# Altium schematic sheet NiosII_VGA.SchDoc: FPGA NiosII VGA Example
size C; Organization: Altium Limited; Address1: L3, 12a Rodborough Rd; Address2: Frenchs Forest; Address3: NSW; Address4: Australia 2086; DocumentNumber: 1; SheetNumber: 1; SheetTotal: 1
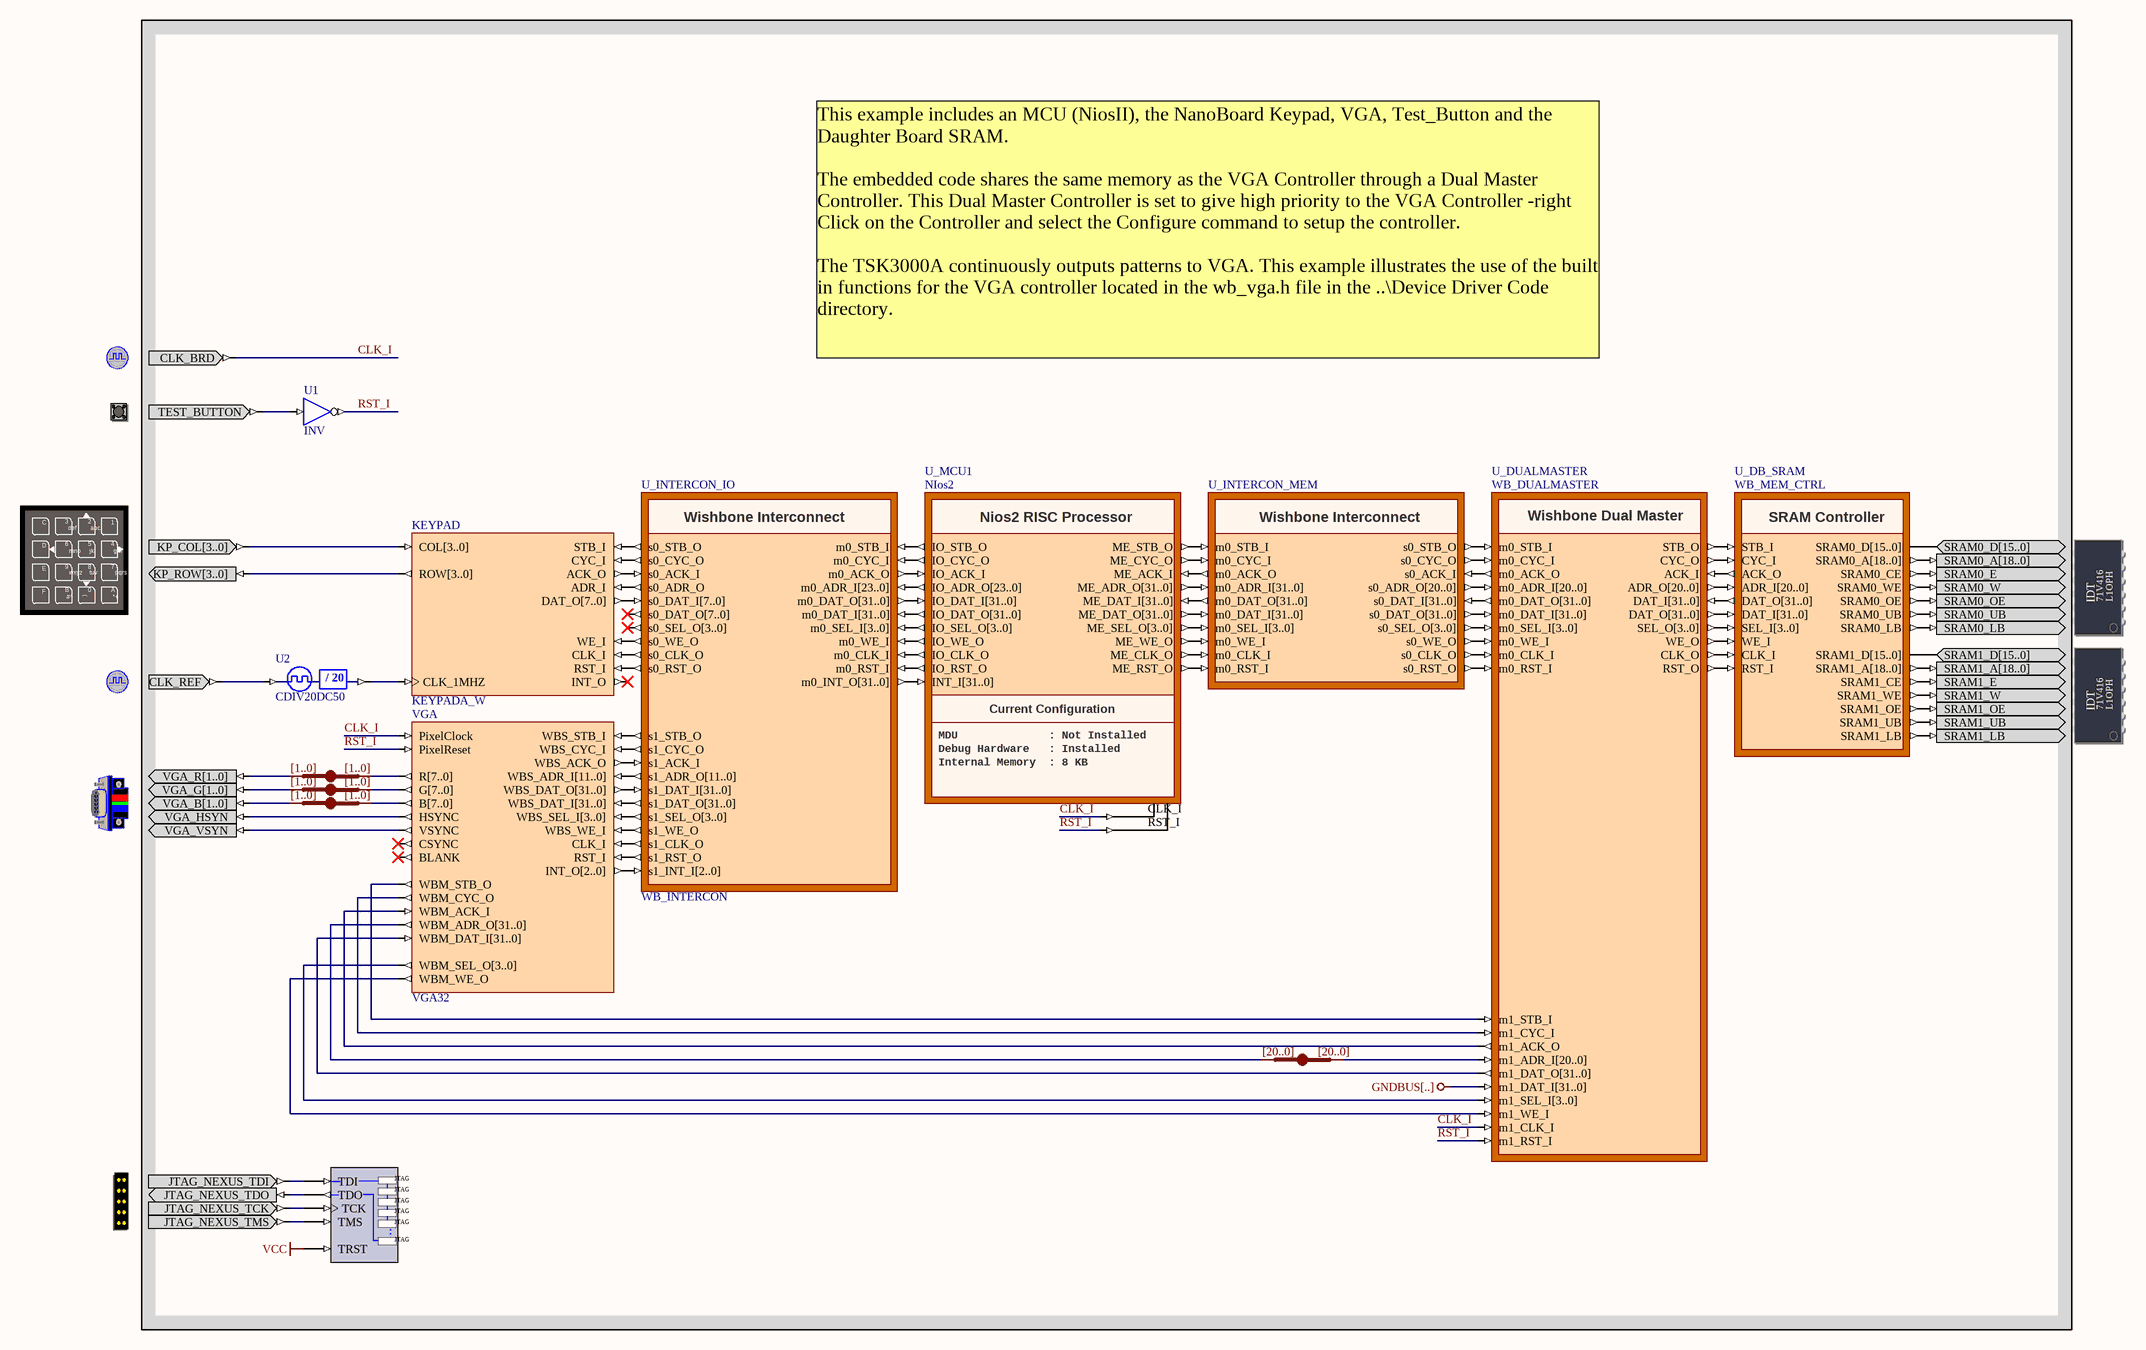
[diagram p0: NiosII_VGA.SchDoc]

## Parts
(Parts that share a designator on the sheet are numbered #1, #2 ... from top to bottom, then left to right.)
?#1  CLOCK_BOARD  (value not drawn)
?#2  TEST_BUTTON  (value not drawn)
?#3  KEYPAD  (value not drawn)
?#4  SRAM_DAUGHTER0  (value not drawn)
?#5  SRAM_DAUGHTER1  (value not drawn)
?#6  CLOCK_REFERENCE  (value not drawn)
?#7  VGACNTR  (value not drawn)
?#8  NEXUS_JTAG_CONNECTOR  (value not drawn)
JB_AUTO?#1  IndexA: [1..0]  (hidden comment: JB)
JB_AUTO?#2  IndexA: [1..0]  (hidden comment: JB)
JB_AUTO?#3  IndexA: [1..0]  (hidden comment: JB)
JB_AUTO?#4  IndexA: [20..0]  (hidden comment: JB)
KEYPAD  KEYPADA_W
NEXUS_JTAG_PORT  NEXUS_JTAG_PORT  (value not drawn)
U1  INV
U2  CDIV20DC50
U_DB_SRAM  WB_MEM_CTRL
U_DUALMASTER  WB_DUALMASTER
U_INTERCON_IO  WB_INTERCON
U_INTERCON_MEM  (no value)
U_MCU1  NIos2
VGA  VGA32

## Nets
GNDBUS[..]: U_DUALMASTER.m1_DAT_I[31..0]
VCC: NEXUS_JTAG_PORT.TRST
CLK_I: ?#1.CLK_BRD U_DUALMASTER.m1_CLK_I U_MCU1.CLK_I VGA.PixelClock
RST_I: U1.O U_DUALMASTER.m1_RST_I U_MCU1.RST_I VGA.PixelReset
Net?#2_TEST_BUTTON: ?#2.TEST_BUTTON U1.I
Net?#3_KP_COL[3..0]: ?#3.KP_COL[3..0] KEYPAD.COL[3..0]
Net?#3_KP_ROW[3..0]: ?#3.KP_ROW[3..0] KEYPAD.ROW[3..0]
Net?#4_SRAM0_A[18..0]: ?#4.SRAM0_A[18..0] U_DB_SRAM.SRAM0_A[18..0]
Net?#4_SRAM0_D[15..0]: ?#4.SRAM0_D[15..0] U_DB_SRAM.SRAM0_D[15..0]
Net?#4_SRAM0_E: ?#4.SRAM0_E U_DB_SRAM.SRAM0_CE
Net?#4_SRAM0_LB: ?#4.SRAM0_LB U_DB_SRAM.SRAM0_LB
Net?#4_SRAM0_OE: ?#4.SRAM0_OE U_DB_SRAM.SRAM0_OE
Net?#4_SRAM0_UB: ?#4.SRAM0_UB U_DB_SRAM.SRAM0_UB
Net?#4_SRAM0_W: ?#4.SRAM0_W U_DB_SRAM.SRAM0_WE
Net?#5_SRAM1_A[18..0]: ?#5.SRAM1_A[18..0] U_DB_SRAM.SRAM1_A[18..0]
Net?#5_SRAM1_D[15..0]: ?#5.SRAM1_D[15..0] U_DB_SRAM.SRAM1_D[15..0]
Net?#5_SRAM1_E: ?#5.SRAM1_E U_DB_SRAM.SRAM1_CE
Net?#5_SRAM1_LB: ?#5.SRAM1_LB U_DB_SRAM.SRAM1_LB
Net?#5_SRAM1_OE: ?#5.SRAM1_OE U_DB_SRAM.SRAM1_OE
Net?#5_SRAM1_UB: ?#5.SRAM1_UB U_DB_SRAM.SRAM1_UB
Net?#5_SRAM1_W: ?#5.SRAM1_W U_DB_SRAM.SRAM1_WE
Net?#6_CLK_REF: ?#6.CLK_REF U2.CLKIN
Net?#7_VGA_B[1..0]: ?#7.VGA_B[1..0] JB_AUTO?#3.A[0..0]
Net?#7_VGA_G[1..0]: ?#7.VGA_G[1..0] JB_AUTO?#2.A[0..0]
Net?#7_VGA_HSYN: ?#7.VGA_HSYN VGA.HSYNC
Net?#7_VGA_R[1..0]: ?#7.VGA_R[1..0] JB_AUTO?#1.A[0..0]
Net?#7_VGA_VSYN: ?#7.VGA_VSYN VGA.VSYNC
Net?#8_JTAG_NEXUS_TCK: ?#8.JTAG_NEXUS_TCK NEXUS_JTAG_PORT.TCK
Net?#8_JTAG_NEXUS_TDI: ?#8.JTAG_NEXUS_TDI NEXUS_JTAG_PORT.TDI
Net?#8_JTAG_NEXUS_TDO: ?#8.JTAG_NEXUS_TDO NEXUS_JTAG_PORT.TDO
Net?#8_JTAG_NEXUS_TMS: ?#8.JTAG_NEXUS_TMS NEXUS_JTAG_PORT.TMS
NetJB_AUTO?#1_B[0..0]: JB_AUTO?#1.B[0..0] VGA.R[7..0]
NetJB_AUTO?#2_B[0..0]: JB_AUTO?#2.B[0..0] VGA.G[7..0]
NetJB_AUTO?#3_B[0..0]: JB_AUTO?#3.B[0..0] VGA.B[7..0]
NetJB_AUTO?#4_A[0..0]: JB_AUTO?#4.A[0..0] VGA.WBM_ADR_O[31..0]
NetJB_AUTO?#4_B[0..0]: JB_AUTO?#4.B[0..0] U_DUALMASTER.m1_ADR_I[20..0]
NetKEYPAD_ACK_O: KEYPAD.ACK_O U_INTERCON_IO.s0_ACK_I
NetKEYPAD_ADR_I: KEYPAD.ADR_I U_INTERCON_IO.s0_ADR_O
NetKEYPAD_CLK_1MHZ: KEYPAD.CLK_1MHZ U2.CLKDV
NetKEYPAD_CLK_I: KEYPAD.CLK_I U_INTERCON_IO.s0_CLK_O
NetKEYPAD_CYC_I: KEYPAD.CYC_I U_INTERCON_IO.s0_CYC_O
NetKEYPAD_DAT_O[7..0]: KEYPAD.DAT_O[7..0] U_INTERCON_IO.s0_DAT_I[7..0]
NetKEYPAD_RST_I: KEYPAD.RST_I U_INTERCON_IO.s0_RST_O
NetKEYPAD_STB_I: KEYPAD.STB_I U_INTERCON_IO.s0_STB_O
NetKEYPAD_WE_I: KEYPAD.WE_I U_INTERCON_IO.s0_WE_O
NetU_DB_SRAM_ACK_O: U_DB_SRAM.ACK_O U_DUALMASTER.ACK_I
NetU_DB_SRAM_ADR_I[20..0]: U_DB_SRAM.ADR_I[20..0] U_DUALMASTER.ADR_O[20..0]
NetU_DB_SRAM_CLK_I: U_DB_SRAM.CLK_I U_DUALMASTER.CLK_O
NetU_DB_SRAM_CYC_I: U_DB_SRAM.CYC_I U_DUALMASTER.CYC_O
NetU_DB_SRAM_DAT_I[31..0]: U_DB_SRAM.DAT_I[31..0] U_DUALMASTER.DAT_O[31..0]
NetU_DB_SRAM_DAT_O[31..0]: U_DB_SRAM.DAT_O[31..0] U_DUALMASTER.DAT_I[31..0]
NetU_DB_SRAM_RST_I: U_DB_SRAM.RST_I U_DUALMASTER.RST_O
NetU_DB_SRAM_SEL_I[3..0]: U_DB_SRAM.SEL_I[3..0] U_DUALMASTER.SEL_O[3..0]
NetU_DB_SRAM_STB_I: U_DB_SRAM.STB_I U_DUALMASTER.STB_O
NetU_DB_SRAM_WE_I: U_DB_SRAM.WE_I U_DUALMASTER.WE_O
NetU_DUALMASTER_m0_ACK_O: U_DUALMASTER.m0_ACK_O U_INTERCON_MEM.s0_ACK_I
NetU_DUALMASTER_m0_ADR_I[20..0]: U_DUALMASTER.m0_ADR_I[20..0] U_INTERCON_MEM.s0_ADR_O[20..0]
NetU_DUALMASTER_m0_CLK_I: U_DUALMASTER.m0_CLK_I U_INTERCON_MEM.s0_CLK_O
NetU_DUALMASTER_m0_CYC_I: U_DUALMASTER.m0_CYC_I U_INTERCON_MEM.s0_CYC_O
NetU_DUALMASTER_m0_DAT_I[31..0]: U_DUALMASTER.m0_DAT_I[31..0] U_INTERCON_MEM.s0_DAT_O[31..0]
NetU_DUALMASTER_m0_DAT_O[31..0]: U_DUALMASTER.m0_DAT_O[31..0] U_INTERCON_MEM.s0_DAT_I[31..0]
NetU_DUALMASTER_m0_RST_I: U_DUALMASTER.m0_RST_I U_INTERCON_MEM.s0_RST_O
NetU_DUALMASTER_m0_SEL_I[3..0]: U_DUALMASTER.m0_SEL_I[3..0] U_INTERCON_MEM.s0_SEL_O[3..0]
NetU_DUALMASTER_m0_STB_I: U_DUALMASTER.m0_STB_I U_INTERCON_MEM.s0_STB_O
NetU_DUALMASTER_m0_WE_I: U_DUALMASTER.m0_WE_I U_INTERCON_MEM.s0_WE_O
NetU_DUALMASTER_m1_ACK_O: U_DUALMASTER.m1_ACK_O VGA.WBM_ACK_I
NetU_DUALMASTER_m1_CYC_I: U_DUALMASTER.m1_CYC_I VGA.WBM_CYC_O
NetU_DUALMASTER_m1_DAT_O[31..0]: U_DUALMASTER.m1_DAT_O[31..0] VGA.WBM_DAT_I[31..0]
NetU_DUALMASTER_m1_SEL_I[3..0]: U_DUALMASTER.m1_SEL_I[3..0] VGA.WBM_SEL_O[3..0]
NetU_DUALMASTER_m1_STB_I: U_DUALMASTER.m1_STB_I VGA.WBM_STB_O
NetU_DUALMASTER_m1_WE_I: U_DUALMASTER.m1_WE_I VGA.WBM_WE_O
NetU_INTERCON_IO_m0_ACK_O: U_INTERCON_IO.m0_ACK_O U_MCU1.IO_ACK_I
NetU_INTERCON_IO_m0_ADR_I[23..0]: U_INTERCON_IO.m0_ADR_I[23..0] U_MCU1.IO_ADR_O[23..0]
NetU_INTERCON_IO_m0_CLK_I: U_INTERCON_IO.m0_CLK_I U_MCU1.IO_CLK_O
NetU_INTERCON_IO_m0_CYC_I: U_INTERCON_IO.m0_CYC_I U_MCU1.IO_CYC_O
NetU_INTERCON_IO_m0_DAT_I[31..0]: U_INTERCON_IO.m0_DAT_I[31..0] U_MCU1.IO_DAT_O[31..0]
NetU_INTERCON_IO_m0_DAT_O[31..0]: U_INTERCON_IO.m0_DAT_O[31..0] U_MCU1.IO_DAT_I[31..0]
NetU_INTERCON_IO_m0_INT_O[31..0]: U_INTERCON_IO.m0_INT_O[31..0] U_MCU1.INT_I[31..0]
NetU_INTERCON_IO_m0_RST_I: U_INTERCON_IO.m0_RST_I U_MCU1.IO_RST_O
NetU_INTERCON_IO_m0_SEL_I[3..0]: U_INTERCON_IO.m0_SEL_I[3..0] U_MCU1.IO_SEL_O[3..0]
NetU_INTERCON_IO_m0_STB_I: U_INTERCON_IO.m0_STB_I U_MCU1.IO_STB_O
NetU_INTERCON_IO_m0_WE_I: U_INTERCON_IO.m0_WE_I U_MCU1.IO_WE_O
NetU_INTERCON_IO_s1_ACK_I: U_INTERCON_IO.s1_ACK_I VGA.WBS_ACK_O
NetU_INTERCON_IO_s1_ADR_O[11..0]: U_INTERCON_IO.s1_ADR_O[11..0] VGA.WBS_ADR_I[11..0]
NetU_INTERCON_IO_s1_CLK_O: U_INTERCON_IO.s1_CLK_O VGA.CLK_I
NetU_INTERCON_IO_s1_CYC_O: U_INTERCON_IO.s1_CYC_O VGA.WBS_CYC_I
NetU_INTERCON_IO_s1_DAT_I[31..0]: U_INTERCON_IO.s1_DAT_I[31..0] VGA.WBS_DAT_O[31..0]
NetU_INTERCON_IO_s1_DAT_O[31..0]: U_INTERCON_IO.s1_DAT_O[31..0] VGA.WBS_DAT_I[31..0]
NetU_INTERCON_IO_s1_INT_I[2..0]: U_INTERCON_IO.s1_INT_I[2..0] VGA.INT_O[2..0]
NetU_INTERCON_IO_s1_RST_O: U_INTERCON_IO.s1_RST_O VGA.RST_I
NetU_INTERCON_IO_s1_SEL_O[3..0]: U_INTERCON_IO.s1_SEL_O[3..0] VGA.WBS_SEL_I[3..0]
NetU_INTERCON_IO_s1_STB_O: U_INTERCON_IO.s1_STB_O VGA.WBS_STB_I
NetU_INTERCON_IO_s1_WE_O: U_INTERCON_IO.s1_WE_O VGA.WBS_WE_I
NetU_INTERCON_MEM_m0_ACK_O: U_INTERCON_MEM.m0_ACK_O U_MCU1.ME_ACK_I
NetU_INTERCON_MEM_m0_ADR_I[31..0]: U_INTERCON_MEM.m0_ADR_I[31..0] U_MCU1.ME_ADR_O[31..0]
NetU_INTERCON_MEM_m0_CLK_I: U_INTERCON_MEM.m0_CLK_I U_MCU1.ME_CLK_O
NetU_INTERCON_MEM_m0_CYC_I: U_INTERCON_MEM.m0_CYC_I U_MCU1.ME_CYC_O
NetU_INTERCON_MEM_m0_DAT_I[31..0]: U_INTERCON_MEM.m0_DAT_I[31..0] U_MCU1.ME_DAT_O[31..0]
NetU_INTERCON_MEM_m0_DAT_O[31..0]: U_INTERCON_MEM.m0_DAT_O[31..0] U_MCU1.ME_DAT_I[31..0]
NetU_INTERCON_MEM_m0_RST_I: U_INTERCON_MEM.m0_RST_I U_MCU1.ME_RST_O
NetU_INTERCON_MEM_m0_SEL_I[3..0]: U_INTERCON_MEM.m0_SEL_I[3..0] U_MCU1.ME_SEL_O[3..0]
NetU_INTERCON_MEM_m0_STB_I: U_INTERCON_MEM.m0_STB_I U_MCU1.ME_STB_O
NetU_INTERCON_MEM_m0_WE_I: U_INTERCON_MEM.m0_WE_I U_MCU1.ME_WE_O

Not connected (* = marked no-connect by the designer): KEYPAD INT_O*; U_INTERCON_IO s0_DAT_O[7..0]* s0_SEL_O[3..0]*; VGA BLANK* CSYNC*

## Notes on the sheet
- This example includes an MCU (NiosII), the NanoBoard Keypad, VGA, Test_Button and the Daughter Board SRAM.
  The embedded code shares the same memory as the VGA Controller through a Dual Master Controller. This Dual Master Controller is set to give high priority to the VGA Controller -right Click on the Controller and select the Configure command to setup the controller.
  The TSK3000A continuously outputs patterns to VGA. This example illustrates the use of the built in functions for the VGA controller located in the wb_vga.h file in the ..\Device Driver Code directory.
- Title
- Size:
- Date:
- File:
- C
- Number:
- Time:
- Revision:
- Sheet
- of
- (in symbol CDIV20DC50) / 20
- (in symbol KEYPAD) C; 3; 2; 1; def; abc; 6; 5; 4; D; mno; jkl; ghi; E; 9; 8; 7; wxyz; tuv; pqrs; F; B; 0; A; #^; (; *+
- (in symbol NEXUS_JTAG_PORT) JTAG; .
- (in symbol Nios2) Current Configuration; MDU              : Not Installed; Debug Hardware   : Installed; Internal Memory  : 8 KB
- (in symbol SRAM_DAUGHTER0) IDT; 71V416; L1OPH
- (in symbol SRAM_DAUGHTER1) IDT; 71V416; L1OPH
- (in symbol WB_DUALMASTER) Wishbone Dual Master
- (in symbol WB_INTERCON) Wishbone Interconnect
- (in symbol WB_MEM_CTRL) SRAM Controller

## Library data of the parts
?#1 = CLOCK_BOARD: Global System Clock Supply; PortComponent: True; Published: 19-Nov-2003; Publisher: Altium Limited
?#2 = TEST_BUTTON: Test Button; PortComponent: True; Published: 19-Nov-2003; Publisher: Altium Limited
?#3 = KEYPAD: Key Pad; PortComponent: True; Published: 19-Nov-2003; Publisher: Altium Limited; HelpURL: TR0102 NanoBoard Technical Reference Manual - NB1.pdf#page=40
?#4 = SRAM_DAUGHTER0: SRAM - 0 Module - Daughterboard; PortComponent: True; Published: 13-May-2004; Publisher: Altium Limited
?#5 = SRAM_DAUGHTER1: SRAM - 1 Module - Daughterboard; PortComponent: True; Published: 13-May-2004; Publisher: Altium Limited
?#6 = CLOCK_REFERENCE: Global System Clock Reference Supply; PortComponent: True; Published: 19-Nov-2003; Publisher: Altium Limited; HelpURL: TR0102 NanoBoard Technical Reference Manual - NB1.pdf#page=29
?#7 = VGACNTR: VGA Dsub-15-Female-HD; PortComponent: True; Published: 19-Nov-2003; Publisher: Altium Limited; HelpURL: TR0102 NanoBoard Technical Reference Manual - NB1.pdf#page=37
?#8 = NEXUS_JTAG_CONNECTOR: JTAG Port; PortComponent: True; Published: 19-Nov-2003; Publisher: Altium Limited
JB_AUTO?#1-JB_AUTO?#4 = JB: System BUS Joiner; Published: 29-Jan-2004; Publisher: Altium Limited; LastRevisionNo: 1.00.00; HelpURL: CR0118 FPGA Generic Library Guide.pdf#page=296; FunctionalClass: Bus Joiner
  JB_AUTO?#1-JB_AUTO?#3: IndexB: [1..0]
  JB_AUTO?#4: IndexB: [20..0]
KEYPAD = KEYPADA_W: Keypad Wishbone; Published: 3-Nov-2004; Publisher: Altium Limited; LastRevisionNo: 1.00.00; HelpURL: CR0106 Keypad Controller.pdf#page=2; ComponentLink1Description: Core &Resource Usage; ComponentLink1URL: CR0139 FPGA Peripheral Resource Usage.pdf#page=15
NEXUS_JTAG_PORT = NEXUS_JTAG_PORT: Soft Nexus-Chain Connector; NEXUS_JTAG_CONNECTOR: True; Published: 18-Dec-2003; Publisher: Altium Limited
U1 = INV: Inverter; ArchiveName: GENERIC; FunctionalClass: Logic Primitive; VHDLIB_SIM: GENERIC_LIB; Published: 18-Dec-2003; Publisher: Altium Limited; ComponentLink1Description: Core &Resource Usage; ComponentLink1URL: CR0136 FPGA Logic Primitive Resource Usage.pdf#page=61; HelpURL: CR0118 FPGA Generic Library Guide.pdf#page=290; LastRevisionNo: 1.00.00; SubClass: INV; XilinxEquivalent: INV
U2 = CDIV20DC50: Clock Divider by 20 with 50% Duty Cycle Output; DivisorRate: 20; DutyCycle: 50; ArchiveName: GENERIC; VHDLIB_SIM: GENERIC_LIB; Published: 29-Jan-2004; Publisher: Altium Limited; LastRevisionNo: 1.00.00; HelpURL: CR0118 FPGA Generic Library Guide.pdf#page=142; ComponentLink1URL: CR0127 FPGA Clock Divider Resource Usage.pdf#page=21; ComponentLink1Description: Core &Resource Usage; FunctionalClass: Clock Divider
U_DB_SRAM = WB_MEM_CTRL: Configurable Memory Controller; ConfigurationParameters: {}Option_MemoryType[Asynchronous SRAM]{}Option_MemorySize[2 Mb (512K x 32-bit)]{}Option_Layout[2 x 16-bit Wide Devices]{}Option_Read[2]{}Option_WriteSetup[1]{}Option_WritePulse[1]{}Option_WriteHold[1]{}; ComponentLink1Description: Core &Resource Usage; ComponentLink1URL: CR0139 FPGA Peripheral Resource Usage.pdf#page=58; HelpURL: CR0152 WB_MEM_CTRL Configurable Wishbone Memory Controller.pdf#page=2; LastRevisionNo: 1.00.00; Published: 9-Dec-2004; Publisher: Altium Limited; ConfiguratorName: WB_MEM_CTRL
U_DUALMASTER = WB_DUALMASTER: Wishbone 2 To 1 Master; ConfigurationParameters: {}DataWidth[0]{}AddressWidth[21]{}SpaceAfter[26]{}DualType[1]{}PriorityDevice[1]; ComponentLink1Description: Core &Resource Usage; ComponentLink1URL: CR0139 FPGA Peripheral Resource Usage.pdf#page=45; HelpURL: CR0151 WB_DUALMASTER Configurable Wishbone Dual Master.pdf#page=2; LastRevisionNo: 1.00.00; Published: 9-Dec-2004; Publisher: Altium Limited; ConfiguratorName: WB_DUALMASTER
U_INTERCON_IO = WB_INTERCON: Configurable Wishbone Interconnect; ConfigurationParameters: {}UnusedInterrupts[1]{}MasterAddressBits[1]{}Name0[KeyPad]{}Kind0[0]{}SpaceAfter0[4]{}Address_Base0[1048576]{}Address_UsedRange0[1]{}Address_Bits0[1]{}Address_Mode0[1]{}Address_DecodeWidth0[4]{}DataWidth0[2]{}UsedInterrupts0[]{}Name1[Video]{}Kind1[0]{}SpaceAfter1[4]{}Address_Base1[0]{}Address_UsedRange1[4]{}Address_Bits1[12]{}Address_Mode1[1]{}Address_DecodeWidth1[4]{}DataWidth1[0]{}UsedInterrupts1[2, 3, 4]; ComponentLink1Description: Core &Resource Usage; ComponentLink1URL: CR0139 FPGA Peripheral Resource Usage.pdf#page=51; HelpURL: CR0150 WB_INTERCON Configurable Wishbone Interconnect.pdf#page=2; LastRevisionNo: 1.00.00; Published: 9-Dec-2004; Publisher: Altium Limited; ConfiguratorName: WB_INTERCON
U_INTERCON_MEM = WB_INTERCON: Configurable Wishbone Interconnect; ConfigurationParameters: {}UnusedInterrupts[2]{}MasterAddressBits[0]{}Name0[Daughter_SRAM]{}Kind0[2]{}SpaceAfter0[14]{}Address_Base0[16777216]{}Address_UsedRange0[524288]{}Address_Bits0[21]{}Address_Mode0[1]{}Address_DecodeWidth0[8]{}DataWidth0[0]{}UsedInterrupts0[]; ComponentLink1Description: Core &Resource Usage; ComponentLink1URL: CR0139 FPGA Peripheral Resource Usage.pdf#page=51; HelpURL: CR0150 WB_INTERCON Configurable Wishbone Interconnect.pdf#page=2; LastRevisionNo: 1.00.00; Published: 9-Dec-2004; Publisher: Altium Limited; ConfiguratorName: WB_INTERCON
U_MCU1 = Nios2: Nios2 RISC Processor; ChildModel1: TSK3000A_MCU; Nexus_JTAG_Device: True; Nexus_Core: Processor_OCDS; Nexus_JTAG_Order: 10; ProgramLogicalTopAddress: 0; ChildModel2: TSK3000A_MDU; ChildModel3: TSK3000A_OCDS; ChildModel4: TSK3000A_Shift_Barrel; ChildModel5: TSK3000A_Shift_Sequential; ChildModel6: Mult_32x32; ConfigurationParameters: {}Version[1.0]{}Option_Processor[5]{}Option_Memory[3]{}Option_MDU[1]{}Option_OCDS[0]{}Option_Shifter[0]{}Option_InterruptCount[32]{}Option_DebugWhenReset[1]{}; ChildModel7: m33x33; Memory_Configuration: Record[PERIPHERAL]{}ComponentDesignator[KeyPad]{}Memory_Depth[0x0002]{}Memory_UsageType[ram]{}ProgramDownloadAddress[0xFF100000]{}Memory_BusType[NiosII:addr_bus]{}Memory_Mau[8]{}Memory_MatchedComponent[]{}Memory_Description[U_INTERCON_IO]{}Memory_FillBitPattern[]{}Memory_Interrupts[]{n}Record[PERIPHERAL]{}ComponentDesignator[Video]{}Memory_Depth[0x1000]{}Memory_UsageType[ram]{}ProgramDownloadAddress[0xFF000000]{}Memory_BusType[NiosII:addr_bus]{}Memory_Mau[8]{}Memory_MatchedComponent[]{}Memory_Description[U_INTERCON_IO]{}Memory_FillBitPattern[]{}Memory_Interrupts[]{n}Record[CODE_EXPORT]{}ExportType[1]{n}Record[NEXUS_CORE]{}ComponentDesignator[U_MCU1]{}Memory_Depth[8k]{}Memory_UsageType[rom]{}ProgramDownloadAddress[0]{}Memory_BusType[NiosII:addr_bus]{}Memory_Mau[8]{}Memory_MatchedComponent[]{}Memory_Description[]{}Memory_FillBitPattern[]{}Memory_Interrupts[]{n}Record[NEXUS_CORE]{}ComponentDesignator[Daughter_SRAM]{}Memory_Depth[0x1FF000]{}Memory_UsageType[ram]{}ProgramDownloadAddress[0x1001000]{}Memory_BusType[NiosII:addr_bus]{}Memory_Mau[8]{}Memory_MatchedComponent[]{}Memory_Description[U_INTERCON_MEM]{}Memory_FillBitPattern[]{}Memory_Interrupts[]{n}Record[NEXUS_CORE]{}ComponentDesignator[ExtraRom]{}Memory_Depth[0x500]{}Memory_UsageType[rom]{}ProgramDownloadAddress[0x1000000]{}Memory_BusType[NiosII:addr_bus]{}Memory_Mau[8]{}Memory_MatchedComponent[]{}Memory_Description[]{}Memory_FillBitPattern[]{}Memory_Interrupts[]{n}Record[NEXUS_CORE]{}ComponentDesignator[RAM]{}Memory_Depth[0xB00]{}Memory_UsageType[rom]{}ProgramDownloadAddress[0x01000500]{}Memory_BusType[NiosII:addr_bus]{}Memory_Mau[8]{}Memory_MatchedComponent[]{}Memory_Description[]{}Memory_FillBitPattern[]{}Memory_Interrupts[]{n}; ConfiguratorName: FPGA_MCU32; ComponentLink1Description: Core &Resource Usage; ComponentLink1URL: CR0140 FPGA Processor Resource Usage.pdf#page=16; HelpURL: CR0121 TSK3000A 32 bit RISC Processor.pdf#page=6; LastRevisionNo: 1.00.00; Published: 17-Nov-2004; Publisher: Altium Limited